# EAGLE design CO2Monitor V0.3 (EAGLE 9.6.2)
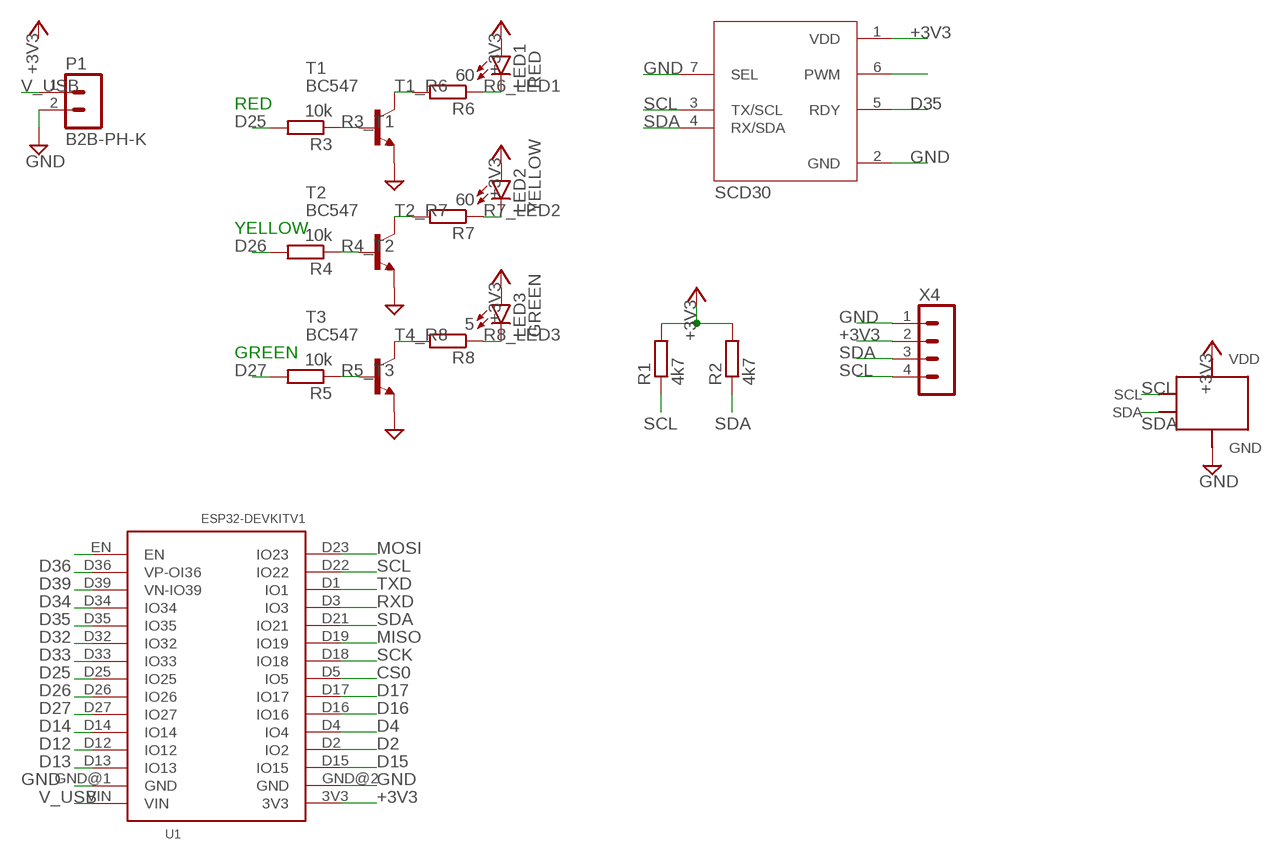
[diagram p0: schematic, sheet 1]

## Parts
LED1  RED  LED5MM  [LED5MM]
LED2  YELLOW  LED5MM  [LED5MM]
LED3  GREEN  LED5MM  [LED5MM]
P1  B2B-PH-K  [B2B-PH-K]
R1  4k7  R-EU_0207/10  [0207/10]
R2  4k7  R-EU_0207/10  [0207/10]
R3  10k  R-EU_0207/10  [0207/10]
R4  10k  R-EU_0207/10  [0207/10]
R5  10k  R-EU_0207/10  [0207/10]
R6  60  R-EU_0207/10  [0207/10]
R7  60  R-EU_0207/10  [0207/10]
R8  5  R-EU_0207/10  [0207/10]
T1  BC547  [TO92]
T2  BC547  [TO92]
T3  BC547  [TO92]
U1  ESP32DEVKITV1  [ESP32-DEVKITV1]
U3  SCD30  [MODULE_SCD30]
X1  1306_0.96"  [1306_0.96"]
X4  B4B-PH-K  [B4B-PH-K]

## Nets
+3V3: LED1.A LED2.A LED3.A R1.2 R2.2 U1.3V3 U3.1(VDD) X1.VDD X4.2
CS0: U1.D5(IO5)
D2: U1.D2(IO2)
D4: U1.D4(IO4)
D12: U1.D12(IO12)
D13: U1.D13(IO13)
D14: U1.D14(IO14)
D15: U1.D15(IO15)
D16: U1.D16(IO16)
D17: U1.D17(IO17)
D25: R3.2 U1.D25(IO25)
D26: R4.2 U1.D26(IO26)
D27: R5.2 U1.D27(IO27)
D32: U1.D32(IO32)
D33: U1.D33(IO33)
D34: U1.D34(IO34)
D35: U1.D35(IO35) U3.5(RDY)
D36: U1.D36(VP-OI36)
D39: U1.D39(VN-IO39)
GND: P1.2 T1.1(E) T2.1(E) T3.1(E) U1.GND@1(GND) U1.GND@2(GND) U3.2(GND) U3.7(SEL) X1.GND X4.1
MISO: U1.D19(IO19)
MOSI: U1.D23(IO23)
N$2: U3.6(PWM)
N$17: U1.EN
R3_T1: R3.1 T1.2(B)
R4_T2: R4.1 T2.2(B)
R5_T3: R5.1 T3.2(B)
R6_LED1: LED1.K(C) R6.1
R7_LED2: LED2.K(C) R7.1
R8_LED3: LED3.K(C) R8.1
RXD: U1.D3(IO3)
SCK: U1.D18(IO18)
SCL: R1.1 U1.D22(IO22) U3.3(TX/SCL) X1.SCL X4.4
SDA: R2.1 U1.D21(IO21) U3.4(RX/SDA) X1.SDA X4.3
T1_R6: R6.2 T1.3(C)
T2_R7: R7.2 T2.3(C)
T4_R8: R8.2 T3.3(C)
TXD: U1.D1(IO1)
V_USB: P1.1 U1.VIN

## Notes on the sheet
- RED
- YELLOW
- GREEN

## Library data of the parts
LED1-LED3 = led:LED: LED OSRAM: - CHIPLED LG R971, LG N971, LY N971, LG Q971, LY Q971, LO R971, LY R971 LH N974, LH R974 LS Q976, LO Q976, LY Q976 LO Q996 - Hyper CHIPLED LW Q18S LB Q993, LB Q99A, LB R99A - SideLED LS A670, LO A670, LY A670, LG A670, LP A670 LB A673, LV A673, LT A673, LW A673 LH A674 LY A675 LS A676, LA A676, LO A676, LY A676, LW A676 LS A679, LY A679, LG A679 - Hyper Micro SIDELED® LS Y876, LA Y876, LO Y876, LY Y876 LT Y87S - SmartLED LW L88C, LW L88S LB L89C, LB L89S, LG L890 LS L89K, LO L89K, LY L89K LS L896, LA L896, LO L896, LY L896 - TOPLED LS T670, LO T670, LY T670, LG T670, LP T670 LSG T670, LSP T670, LSY T670, LOP T670, LYG T670 LG T671, LOG T671, LSG T671 LB T673, LV T673, LT T673, LW T673 LH T674 LS T676, LA T676, LO T676, LY T676, LB T676, LH T676, LSB T676, LW T676 LB T67C, LV T67C, LT T67C, LS T67K, LO T67K, LY T67K, LW E67C LS E67B, LA E67B, LO E67B, LY E67B, LB E67C, LV E67C, LT E67C LW T67C LS T679, LY T679, LG T679 LS T770, LO T770, LY T770, LG T770, LP T770 LB T773, LV T773, LT T773, LW T773 LH T774 LS E675, LA E675, LY E675, LS T675 LS T776, LA T776, LO T776, LY T776, LB T776 LHGB T686 LT T68C, LB T68C - Hyper Mini TOPLED® LB M676 - Mini TOPLED Santana® LG M470 LS M47K, LO M47K, LY M47K Source: http://www.osram.convergy.de LUXEON: - LUMILED® LXK2-PW12-R00, LXK2-PW12-S00, LXK2-PW14-U00, LXK2-PW14-V00 LXK2-PM12-R00, LXK2-PM12-S00, LXK2-PM14-U00 LXK2-PE12-Q00, LXK2-PE12-R00, LXK2-PE12-S00, LXK2-PE14-T00, LXK2-PE14-U00 LXK2-PB12-K00, LXK2-PB12-L00, LXK2-PB12-M00, LXK2-PB14-N00, LXK2-PB14-P00, LXK2-PB14-Q00 LXK2-PR12-L00, LXK2-PR12-M00, LXK2-PR14-Q00, LXK2-PR14-R00 LXK2-PD12-Q00, LXK2-PD12-R00, LXK2-PD12-S00 LXK2-PH12-R00, LXK2-PH12-S00 LXK2-PL12-P00, LXK2-PL12-Q00, LXK2-PL12-R00 Source: www.luxeon.com KINGBRIGHT: KA-3528ASYC Source: www.kingbright.com
P1 = con-jst-ph:B2B-PH-K: HEADER
R1-R8 = rcl:R-EU_: RESISTOR, European symbol; SPICEPREFIX: R
T1-T3 = transistor-npn:BC547*: NPN Transistor
U1 = ESP32-DEVKITV1:ESP32DEVKITV1
U3 = SCD30:SCD30: SCD30 Series 5.5 V 75 mA ±3% Carbon Dioxide (CO2) Sensor Module Check prices <https://pricing.snapeda.com/parts/SCD30/Sensirion%20AG/view-part?ref=eda>; AVAILABILITY: In Stock; DESCRIPTION: Carbon Dioxide (CO2) Sensor I²C, Modbus, PWM; MF: Sensirion AG; MP: SCD30; PACKAGE: None; PRICE: None; PURCHASE-URL: https://pricing.snapeda.com/search/part/SCD30/?ref=eda
X1 = SSD1306:1306_0.96"
X4 = con-jst-ph:B4B-PH-K: HEADER

## Board
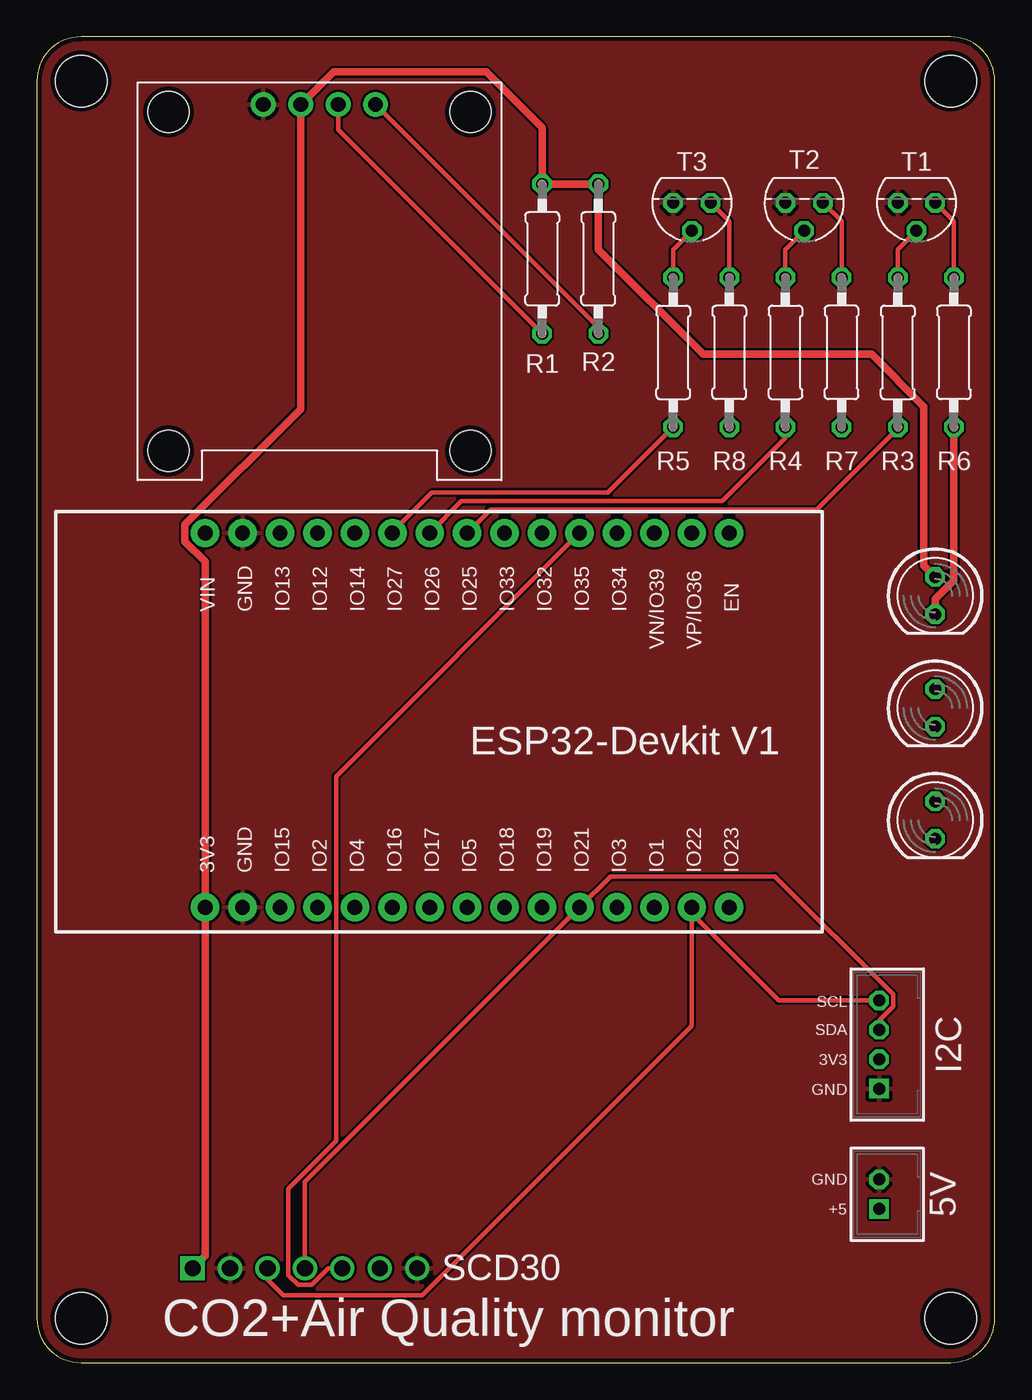
[diagram p1: board, top side]
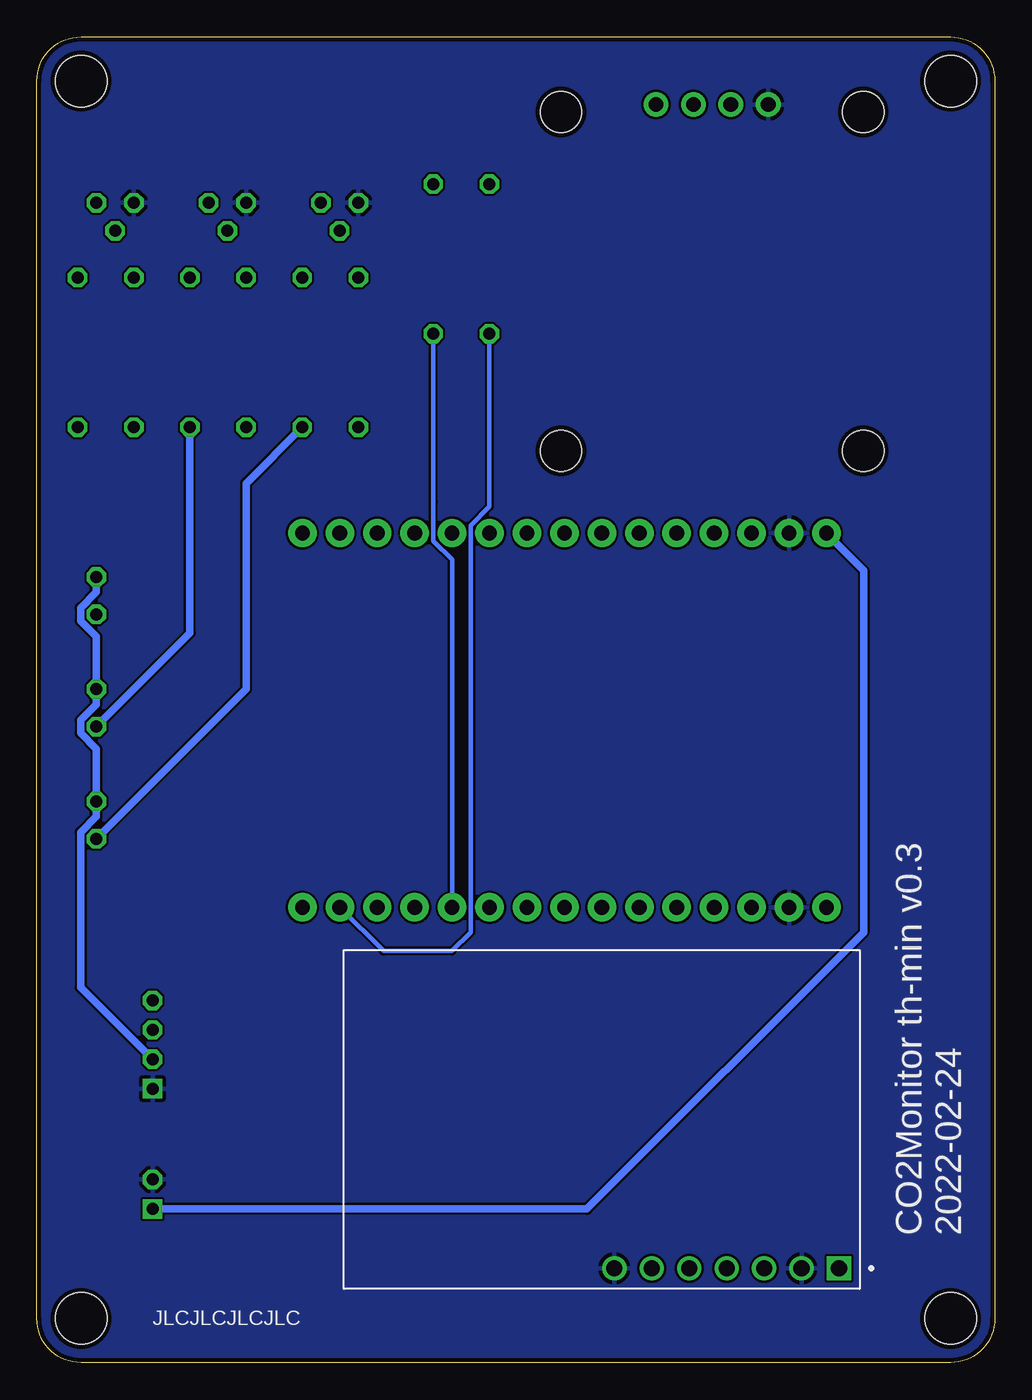
[diagram p2: board, bottom side, seen from below]

Size 65 x 90 mm. Coordinates in mm from the lower left corner, seen from the top.
Outline: 62,90 3,90 arc90 0,87 0,3 arc90 3,0 62,0 arc90 65,3 65,87 arc90 62,90
Copper layers (1*16): Top 0.035mm / dielectric 1.5mm / Bottom 0.035mm
Design rules "Seeed": minimum track width 6mil, minimum drill 0.3mm, track to track 6mil, track to pad 6mil, pad to pad 6mil, via to via 12mil, smd to smd 6mil, copper to edge 12mil, drill to drill 6mil, minimum pad ring 10mil, minimum via ring 8mil, stop-mask expansion 4mil, vias tented up to drill 20mil, thermal gap 10mil
Holes 3.5 mm at 3,3 62,3 62,87 3,87

### Footprints (pad centres in the part's own frame; a part is rotated, then mirrored left to right if it is on the bottom)
LED5MM = drill 0.813 octagon: A -1.27,0; K 1.27,0
B2B-PH-K = drill 0.813 square: 1 -1,0 | drill 0.813 octagon: 2 1,0
0207/10 = drill 0.813 octagon: 1 -5.08,0; 2 5.08,0
TO92 = drill 0.813 octagon: 1 1.27,0; 2 0,1.905; 3 -1.27,0
ESP32-DEVKITV1 = drill 1 pad 1.93: 3V3 -16.52,-12.27; D1 13.96,-12.27; D2 -8.9,-12.27; D3 11.42,-12.27; D4 -6.36,-12.27; D5 1.26,-12.27; D12 -8.9,13.135; D13 -11.44,13.135; D14 -6.36,13.135; D15 -11.44,-12.27; D16 -3.82,-12.27; D17 -1.28,-12.27; D18 3.8,-12.27; D19 6.34,-12.27; D21 8.88,-12.27; D22 16.5,-12.27; D23 19.04,-12.27; D25 1.26,13.135; D26 -1.28,13.135; D27 -3.82,13.135; D32 6.34,13.135; D33 3.8,13.135; D34 11.42,13.135; D35 8.88,13.135; D36 16.5,13.135; D39 13.96,13.135; EN 19.04,13.135; GND@1 -13.98,13.135; GND@2 -13.98,-12.27; VIN -16.52,13.135
MODULE_SCD30 = drill 1.1 square: 1 -16.1,10.1 | drill 1.1: 2 -13.56,10.1; 3 -11.02,10.1; 4 -8.48,10.1; 5 -5.94,10.1; 6 -3.4,10.1; 7 -0.86,10.1
1306_0.96" = drill 1 pad 1.676: GND -3.81,12; SCL 1.27,12; SDA 3.81,12; VDD -1.27,12 | hole 2.8: -10.25,11.5; 10.25,11.5; -10.25,-11.5; 10.25,-11.5
B4B-PH-K = drill 0.813 square: 1 -3,0 | drill 0.813 octagon: 2 -1,0; 3 1,0; 4 3,0

### Placement (x,y rotation side)
LED1  60.96,52.07 270 top
LED2  60.96,44.45 270 top
LED3  60.96,36.83 270 top
P1  57.15,11.43 90 top
R1  34.29,74.93 90 top
R2  38.1,74.93 90 top
R3  58.42,68.58 270 top
R4  50.8,68.58 270 top
R5  43.18,68.58 270 top
R6  62.23,68.58 90 top
R7  54.61,68.58 90 top
R8  46.99,68.58 90 top
T1  59.69,78.74 180 top
T2  52.07,78.74 180 top
T3  44.45,78.74 180 top
U1  27.94,43.18 0 top
U3  26.67,16.51 180 bottom
X1  19.18,73.4 0 top
X4  57.15,21.59 90 top

### Tracks (layer width: path | path; a pad name or v marks a point on that pad's centre or on a via)
+3V3
  Top 0.508: LED1.A 60.2,54.1 60.2,64.9 56.64,68.45 45.21,68.45 38.1,75.56 R2.2 R1.2 34.29,83.82 30.48,87.63 20.13,87.63 X1.VDD 17.91,64.74 10.05,56.88 10.05,55.75 11.42,54.38 U1.3V3 11.42,7.26 U3.1
  Bottom 0.508: LED1.A 60.96,52.31 62.03,51.24 62.03,50.36 60.96,49.29 LED2.A 60.96,44.69 62.03,43.62 62.03,42.74 60.96,41.67 LED3.A 60.96,37.07 62.03,36 62.03,25.47 X4.2
D25
  Top 0.305: U1.D25 30.8,57.91 52.93,57.91 58.42,63.41 R3.2
D26
  Top 0.305: U1.D26 28.82,58.47 46.5,58.47 50.8,62.77 R4.2
D27
  Top 0.305: R5.2 38.73,59.05 26.8,59.05 24.12,56.38 U1.D27
D35
  Top 0.305: U1.D35 20.31,39.8 20.31,15.05 17.06,11.8 17.06,5.94 17.72,5.28 18.66,5.28 19.79,6.41 U3.5
GND
  pour Top: -2.54,-2.54 72.39,-2.54 72.39,91.44 -2.54,91.44
  pour Bottom: -5.08,-5.08 73.66,-5.08 73.66,92.71 -5.08,92.71
R3_T1
  Top 0.305: R3.1 58.42,75.56 T1.2
R4_T2
  Top 0.305: R4.1 50.8,75.56 T2.2
R5_T3
  Top 0.305: R5.1 43.18,75.56 T3.2
R6_LED1
  Top 0.508: LED1.K 60.96,51.83 62.23,53.1 R6.1
R7_LED2
  Bottom 0.508: LED2.K 54.61,49.53 R7.1
R8_LED3
  Bottom 0.508: LED3.K 50.8,45.72 50.8,59.69 R8.1
SCL
  Top 0.305: U3.3 15.65,5.65 16.73,4.57 26.16,4.57 44.44,22.85 44.44,30.48 | 44.44,30.48 U1.D22 | X4.4 50.33,24.59 44.44,30.48 | X1.SCL 20.45,83.69 R1.1
  Bottom 0.305: R1.1 34.29,58.1 35.55,56.84 35.55,29.22 36.83,27.94 41.47,27.94 U1.D22
SDA
  Top 0.305: U3.4 18.19,12.28 U1.D21 38.93,33.02 50.09,33.02 58.12,24.99 58.12,24.19 57.15,23.23 X4.3 | X1.SDA 38.1,70.29 R2.1
  Bottom 0.305: U1.D21 36.82,54.52 38.09,55.79 38.09,58.41 38.1,58.42 R2.1
T1_R6
  Top 0.305: T1.3 62.23,77.47 R6.2
T2_R7
  Top 0.305: T2.3 54.61,77.47 R7.2
T4_R8
  Top 0.305: T3.3 46.99,77.47 R8.2
V_USB
  Bottom 0.508: U1.VIN 8.89,53.78 8.89,29.21 27.67,10.43 P1.1

### Text on the board
tNames: SCL | SDA | I2C | 3V3 | GND | GND | 5V | +5 | SCD30 | CO2+Air Quality monitor
bNames: CO2Monitor th-min v0.3 / 2022-02-24 | JLCJLCJLCJLC